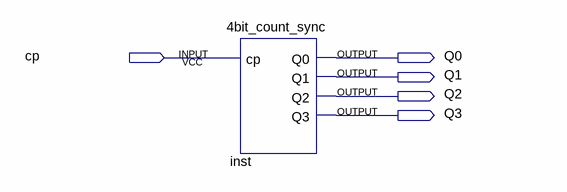
[diagram p0: schematic sheet]
// Quartus schematic Chapter5-2.bdf as structural Verilog: 1 symbols, 5 pins
module \Chapter5-2  (
  input  cp,
  output Q0,
  output Q1,
  output Q2,
  output Q3
);

  \4bit_count_sync  inst (.cp(cp), .Q0(Q0), .Q1(Q1), .Q2(Q2), .Q3(Q3));
endmodule
